# Altium schematic sheet main.SchDoc
size A4
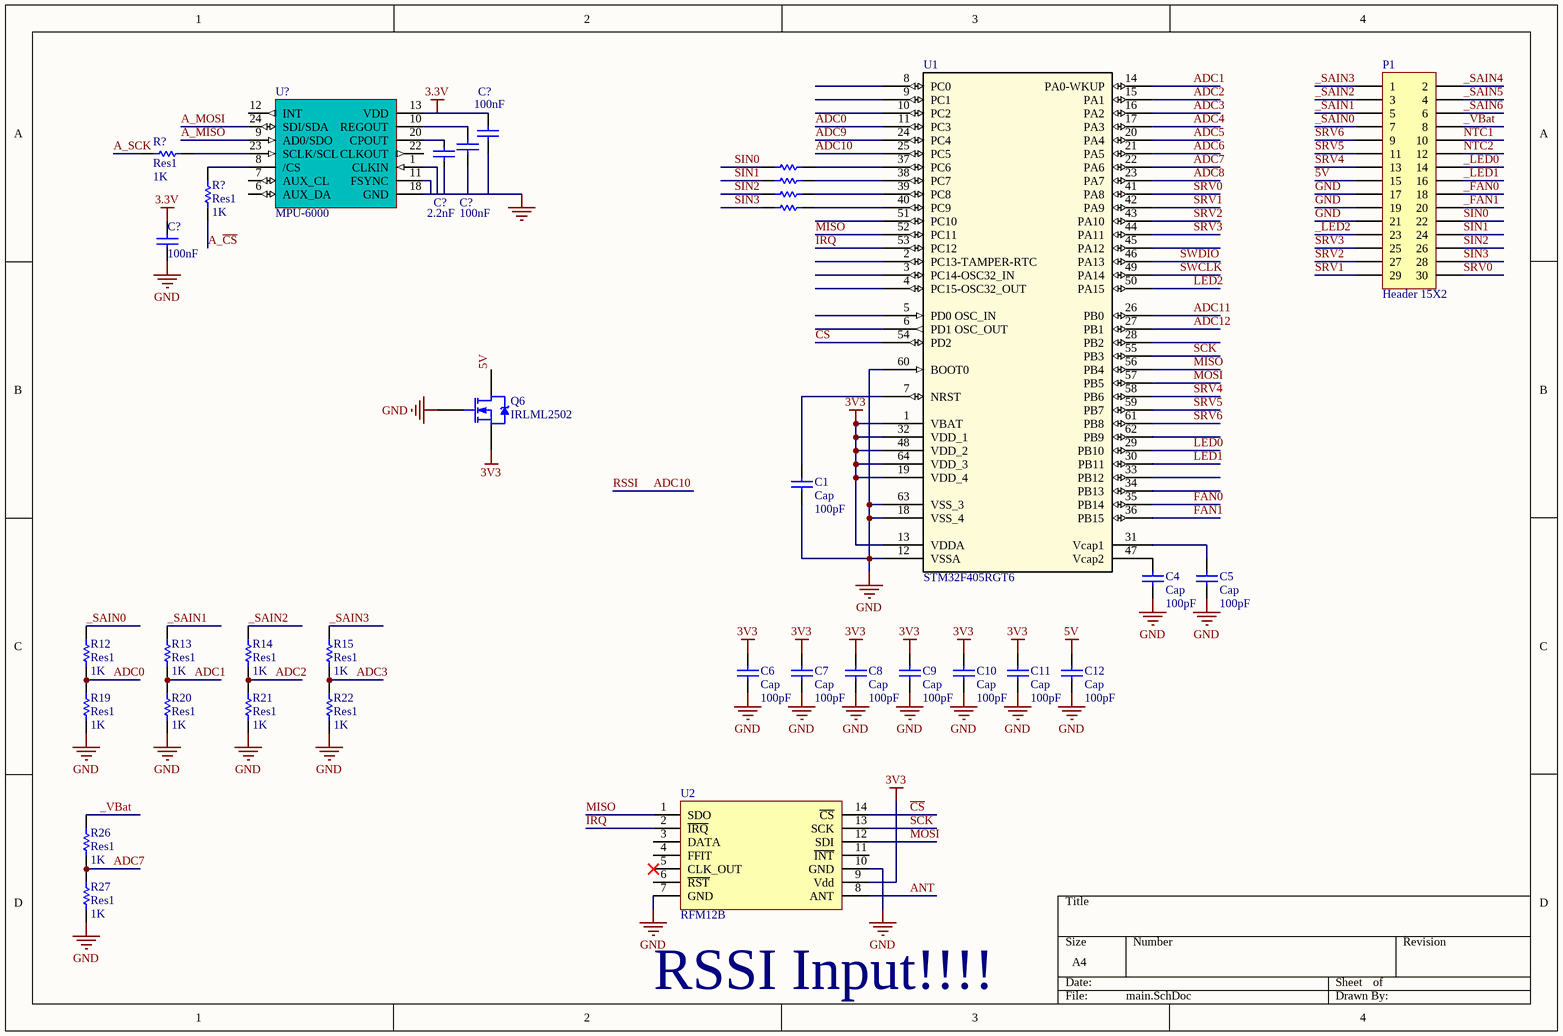
[diagram p0: main.SchDoc]

## Parts
(Parts that share a designator on the sheet are numbered #1, #2 ... from top to bottom, then left to right.)
C1  Cap  value 100pF  [RC_0603]
C4  Cap  value 100pF  [RC_0603]
C5  Cap  value 100pF  [RC_0603]
C6  Cap  value 100pF  [RC_0603]
C7  Cap  value 100pF  [RC_0603]
C8  Cap  value 100pF  [RC_0603]
C9  Cap  value 100pF  [RC_0603]
C10  Cap  value 100pF  [RC_0603]
C11  Cap  value 100pF  [RC_0603]
C12  Cap  value 100pF  [RC_0603]
C?#1  value 100nF  [0603x]  (hidden comment: Cap402)
C?#2  value 100nF  [0402x]  (hidden comment: Cap402)
C?#3  value 2.2nF  [0603x]  (hidden comment: Cap603)
C?#4  value 100nF  [RR_B]  (hidden comment: Cap)
P1  Header 15X2  [HDR2X15-2mm]
Q6  IRLML2502  [RR_SOT-23]
R4  Res1  [RR_0603]  (value not drawn)
R5  Res1  [RR_0603]  (value not drawn)
R6  Res1  [RR_0603]  (value not drawn)
R7  Res1  [RR_0603]  (value not drawn)
R12  Res1  value 1K  [RR_0603]
R13  Res1  value 1K  [RR_0603]
R14  Res1  value 1K  [RR_0603]
R15  Res1  value 1K  [RR_0603]
R19  Res1  value 1K  [RR_0603]
R20  Res1  value 1K  [RR_0603]
R21  Res1  value 1K  [RR_0603]
R22  Res1  value 1K  [RR_0603]
R26  Res1  value 1K  [RR_0603]
R27  Res1  value 1K  [RR_0603]
R?#1  Res1  value 1K  [0805x]
R?#2  Res1  value 1K  [0603x]
U1  STM32F405RGT6  [RR_LQFP-64]
U2  RFM12B
U?  MPU-6000  [IMU-3000]

## Nets
3.3V: C?#1.2 C?#4.2 U?.13(VDD)
3V3: C6.2 C7.2 C8.2 C9.2 C10.2 C11.2 Q6.2(S) U1.1(VBAT) U1.13(VDDA) U1.19(VDD_4) U1.32(VDD_1) U1.48(VDD_2) U1.64(VDD_3) U2.9(Vdd)
5V: C12.2 P1.15 Q6.3(D)
GND: C1.1 C4.1 C5.1 C6.1 C7.1 C8.1 C9.1 C10.1 C11.1 C12.1 C?#1.1 C?#2.2 C?#3.1 C?#4.1 P1.17 P1.19 P1.21 Q6.1(G) R19.1 R20.1 R21.1 R22.1 R27.1 U1.12(VSSA) U1.18(VSS_4) U1.60(BOOT0) U1.63(VSS_3) U2.7(GND) U2.10(GND) U?.1(CLKIN) U?.11(FSYNC) U?.18(GND)
_FAN0: P1.18
_FAN1: P1.20
_LED0: P1.14
_LED1: P1.16
_LED2: P1.23
_SAIN0: P1.7 R12.2
_SAIN1: P1.5 R13.2
_SAIN2: P1.3 R14.2
_SAIN3: P1.1 R15.2
_SAIN4: P1.2
_SAIN5: P1.4
_SAIN6: P1.6
_VBat: P1.8 R26.2
A_~{CS}: R?#2.1
A_MISO: U?.9(AD0/SDO)
A_MOSI: U?.24(SDI/SDA)
A_SCK: R?#1.1
ADC0: R12.1 R19.2 U1.11(PC3)
ADC1: R13.1 R20.2 U1.14(PA0-WKUP)
ADC2: R14.1 R21.2 U1.15(PA1)
ADC3: R15.1 R22.2 U1.16(PA2)
ADC4: U1.17(PA3)
ADC5: U1.20(PA4)
ADC6: U1.21(PA5)
ADC7: R26.1 R27.2 U1.22(PA6)
ADC8: U1.23(PA7)
ADC9: U1.24(PC4)
ADC10: U1.25(PC5)  [also labelled RSSI]
ADC11: U1.26(PB0)
ADC12: U1.27(PB1)
ANT: U2.8(ANT)
~{CS}: U1.54(PD2) U2.14(~{CS})
FAN0: U1.35(PB14)
FAN1: U1.36(PB15)
~{IRQ}: U1.53(PC12) U2.2(~{IRQ})
LED0: U1.29(PB10)
LED1: U1.30(PB11)
LED2: U1.50(PA15)
MISO: U1.52(PC11) U1.56(PB4) U2.1(SDO)
MOSI: U1.57(PB5) U2.12(SDI)
NTC1: P1.10
NTC2: P1.12
SCK: U1.55(PB3) U2.13(SCK)
SIN0: P1.22 R4.2
SIN1: P1.24 R5.2
SIN2: P1.26 R6.2
SIN3: P1.28 R7.2
SRV0: P1.30 U1.41(PA8)
SRV1: P1.29 U1.42(PA9)
SRV2: P1.27 U1.43(PA10)
SRV3: P1.25 U1.44(PA11)
SRV4: P1.13 U1.58(PB6)
SRV5: P1.11 U1.59(PB7)
SRV6: P1.9 U1.61(PB8)
SWCLK: U1.49(PA14)
SWDIO: U1.46(PA13)
NetC1_2: C1.2 U1.7(NRST)
NetC4_2: C4.2 U1.47(Vcap2)
NetC5_2: C5.2 U1.31(Vcap1)
NetC?#2_1: C?#2.1 U?.10(REGOUT)
NetC?#3_2: C?#3.2 U?.20(CPOUT)
NetR4_1: R4.1 U1.37(PC6)
NetR5_1: R5.1 U1.38(PC7)
NetR6_1: R6.1 U1.39(PC8)
NetR7_1: R7.1 U1.40(PC9)
NetR?#1_2: R?#1.2 U?.23(SCLK/SCL)
NetR?#2_2: R?#2.2 U?.8(/CS)

Not connected (* = marked no-connect by the designer): U1 2(PC13-TAMPER-RTC) 3(PC14-OSC32_IN) 4(PC15-OSC32_OUT) 5(PD0_OSC_IN) 6(PD1_OSC_OUT) 8(PC0) 9(PC1) 10(PC2) 28(PB2) 33(PB12) 34(PB13) 45(PA12) 51(PC10) 62(PB9); U2 3(DATA) 4(FFIT) 5(CLK_OUT)* 6(~{RST}) 11(~{INT}); U? 2(NC) 3(NC) 4(NC) 5(NC) 6(AUX_DA) 7(AUX_CL) 12(INT) 14(NC) 15(NC) 16(NC) 17(NC) 19(RESV) 21(RESV) 22(CLKOUT)

## Notes on the sheet
- (near U2) RSSI Input!!!!

## Library data of the parts
C1 C4-C12 C?#4 = Cap: Capacitor; Published: 8-Jun-2000; LatestRevisionDate: 17-Jul-2002; LatestRevisionNote: Re-released for DXP Platform.; PackageReference: RAD-0.3; Publisher: Altium Limited; PackageDescription: Radial Cap, Thru-Hole; 2 Leads; 0.3 in Pin Spacing
C?#1 C?#2 = Cap402: Capacitor SMD; Published: 1-Nov-2010; LatestRevisionDate: 1-Nov-2010; LatestRevisionNote: Released OpenPilot Lib; PackageReference: 0402 (1005 Metric); Publisher: The OpenPilot Project; ComponentLink2Description: Datasheet; Supplier 1: Digi-Key; Supplier Part Number 1: 445-4952-1-ND
C?#3 = Cap603: Capacitor SMD; Published: 1-Nov-2010; LatestRevisionDate: 1-Nov-2010; LatestRevisionNote: Released OpenPilot Lib; PackageReference: 0603 (1608 Metric); Publisher: The OpenPilot Project; Supplier 1: Digi-Key; Supplier Part Number 1: 445-1309-1-ND
P1 = Header 15X2: Header, 15-Pin, Dual row; LatestRevisionDate: 17-Jul-2002; LatestRevisionNote: Re-released for DXP Platform.; Publisher: Altium Limited
Q6 = IRLML2502: MOSFET N-CH 20V 4.2A SOT-23-3; Manufacturer: Infineon Technologies; Order Number: IRLML2502GTRPBF ( IRLML6246TRPBF (INFIN)); Cost: 0,52; Package: SOT-23; Value: MOSFET N-CH 20V 4.2A SOT-23-3
R4-R7 = Res1: Resistor; Value: 1K; Published: 8-Jun-2000; LatestRevisionDate: 17-Jul-2002; LatestRevisionNote: Re-released for DXP Platform.; PackageReference: AXIAL-0.3; Publisher: Altium Limited; PackageDescription: Axial Device, Thru-Hole; 2 Leads; 0.3 in Pin Spacing
R12-R15 R19-R22 R26 R27 R?#1 R?#2 = Res1: Resistor; Published: 8-Jun-2000; LatestRevisionDate: 17-Jul-2002; LatestRevisionNote: Re-released for DXP Platform.; PackageReference: AXIAL-0.3; Publisher: Altium Limited; PackageDescription: Axial Device, Thru-Hole; 2 Leads; 0.3 in Pin Spacing
U1 = STM32F405RGT6: MCU STM32F405RGT6; Manufacturer: ST Microelectronics; Value: IC MCU 32BIT 1MB FLASH 64LQFP; Order Number: STM32F405RGT6; Cost: 10,58; Package: 64-LQFP
U2 = Component_1
U? = MPU-3/6000: Invensense MPU-3/6000,  3-axis Gyros & Accel on 6000; ComponentLink2Description: Datasheet; LatestRevisionDate: 1-Nov-2010; LatestRevisionNote: Released OpenPilot Lib; Published: 1-Nov-2010; Publisher: The OpenPilot Project; Manufacturer: Invensense; Supplier 1: Invensense; Supplier Part Number 1: MPU-6000